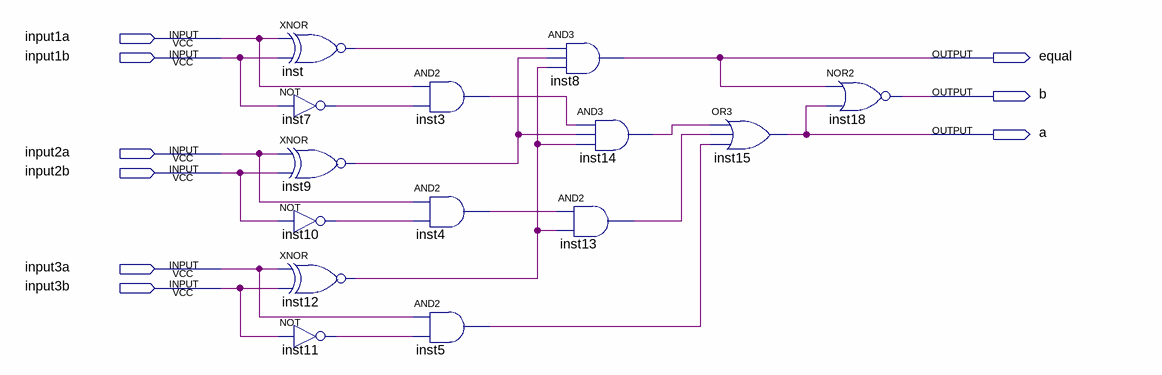
[diagram p0: schematic sheet]
// Quartus schematic sifo.bdf as structural Verilog: 14 symbols, 9 pins
module sifo (
  input  input1a,
  input  input1b,
  input  input2a,
  input  input2b,
  input  input3a,
  input  input3b,
  output equal,
  output b,
  output a
);

  wire inst3_out, inst4_out, inst5_out, inst7_out, inst9_out, inst10_out, inst11_out, inst12_out, inst13_out,
       inst14_out, inst_out;

  xnor inst (inst_out, input1a, input1b);
  not inst7 (inst7_out, input1b);
  xnor inst9 (inst9_out, input2a, input2b);
  not inst10 (inst10_out, input2b);
  xnor inst12 (inst12_out, input3a, input3b);
  not inst11 (inst11_out, input3b);
  and inst3 (inst3_out, input1a, inst7_out);
  and inst4 (inst4_out, input2a, inst10_out);
  and inst5 (inst5_out, input3a, inst11_out);
  and inst8 (equal, inst_out, inst9_out, inst12_out);
  and inst14 (inst14_out, inst3_out, inst9_out, inst12_out);
  and inst13 (inst13_out, inst4_out, inst12_out);
  or inst15 (a, inst14_out, inst13_out, inst5_out);
  nor inst18 (b, equal, a);
endmodule
